# EAGLE schematic H05 (EAGLE 6.6.0)

## Sheet 1 of 4
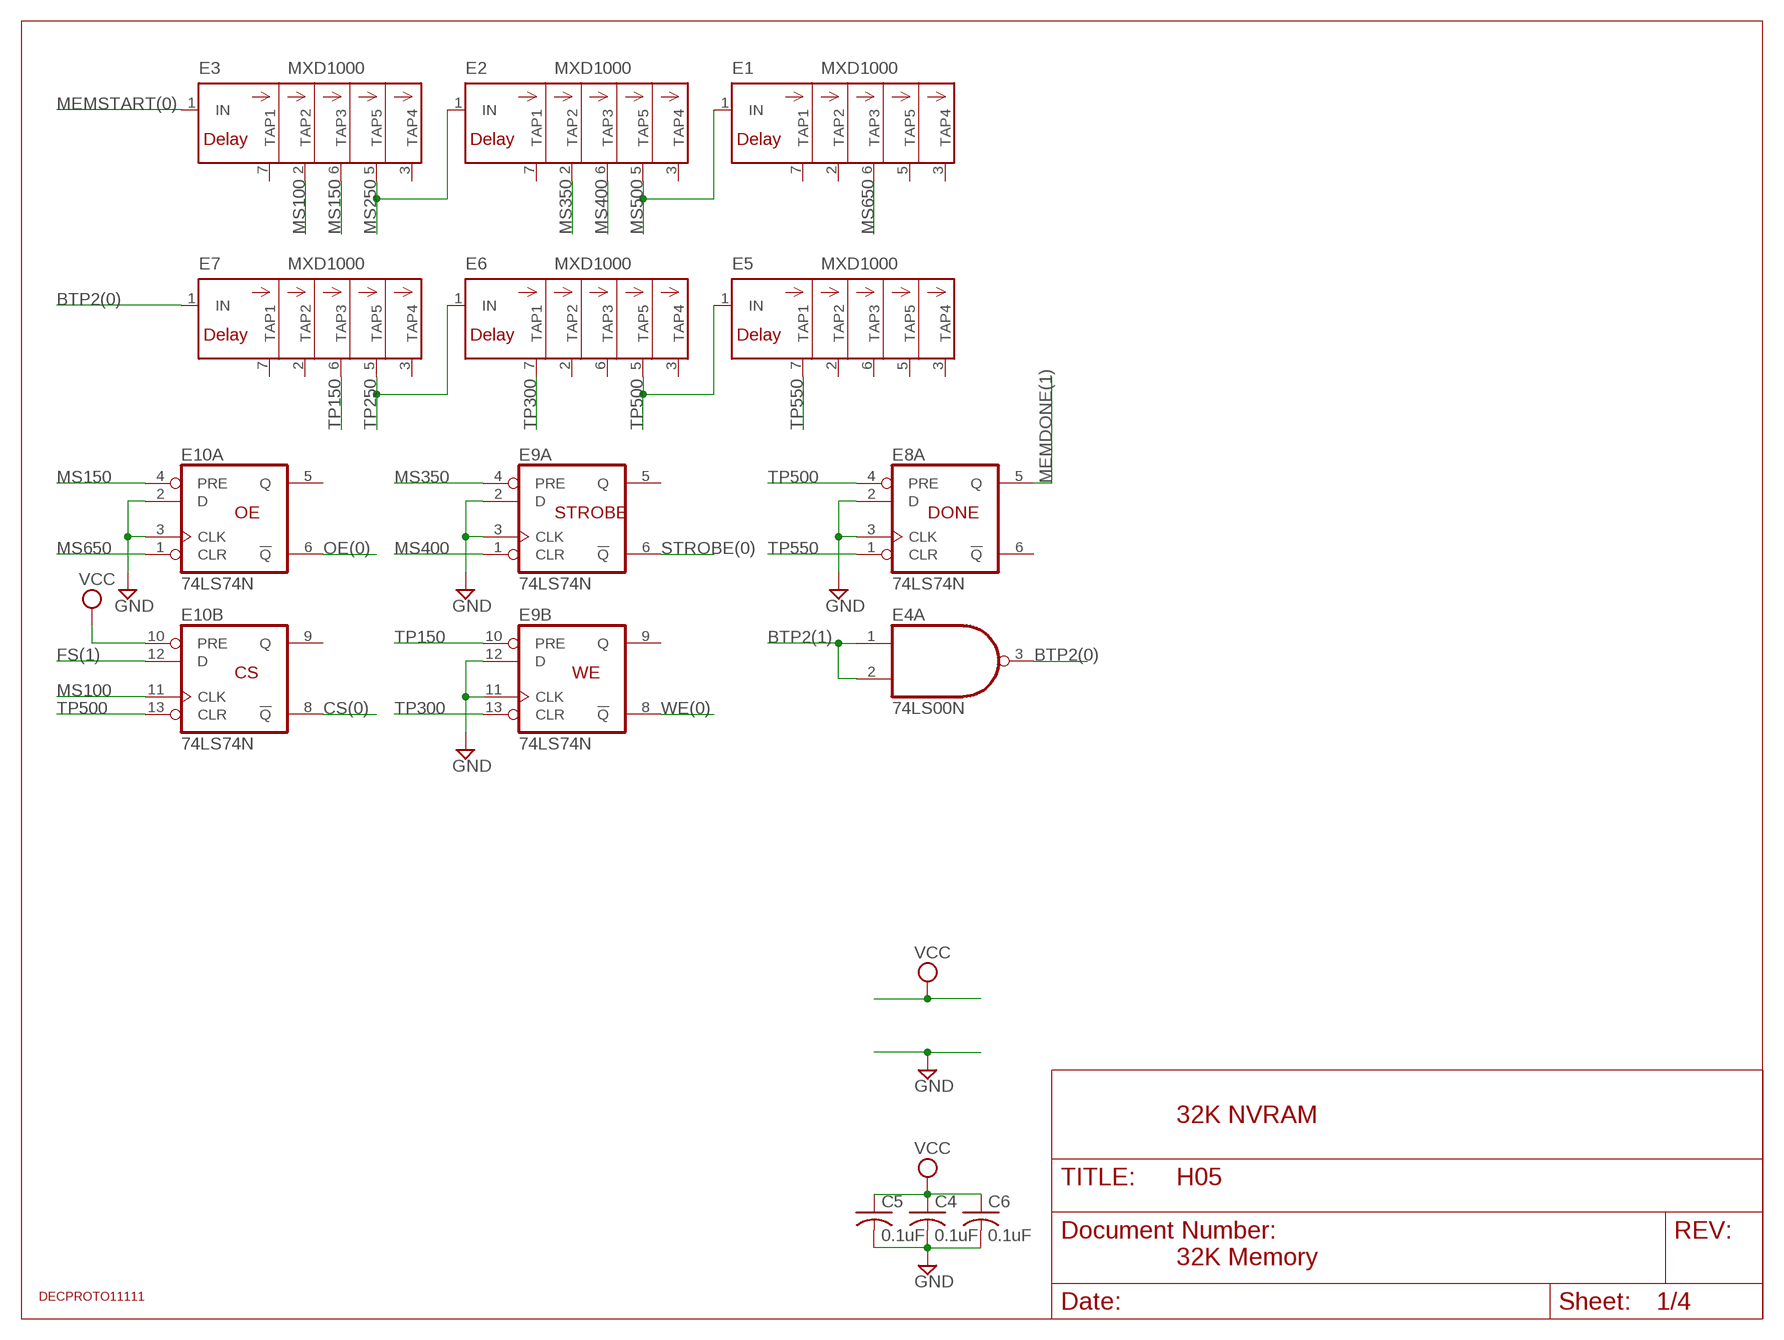
[diagram p0: schematic, sheet 1]

### Parts
C4  0.1uF  C-US050-025X075  [C050-025X075]
C5  0.1uF  C-US050-025X075  [C050-025X075]
C6  0.1uF  C-US050-025X075  [C050-025X075]
E1  MXD1000  [DIL08]
E2  MXD1000  [DIL08]
E3  MXD1000  [DIL08]
E4  74LS00N  [DIL14]
E5  MXD1000  [DIL08]
E6  MXD1000  [DIL08]
E7  MXD1000  [DIL08]
E8  74LS74N  [DIL14]
E9  74LS74N  [DIL14]
E10  74LS74N  [DIL14]
U$6  DECPROTO11111  [DECPROTO11111]

### Nets
BTP2(0): E4.3(A:O) E7.1(IN)
BTP2(1): E4.1(A:I0) E4.2(A:I1) ; also sheet 2
CS(0): E10.8(B:!Q) ; also sheet 3
FS(1): E10.12(B:D) ; also sheet 3
GND [supply]: C4.2 C5.2 C6.2 E8.2(A:D) E8.3(A:CLK) E9.2(A:D) E9.3(A:CLK) E9.11(B:CLK) E9.12(B:D) E10.2(A:D) E10.3(A:CLK) ; also sheet 2,3
MEMDONE(1): E8.5(A:Q) ; also sheet 2
MEMSTART(0): E3.1(IN) ; also sheet 2
MS100: E3.2(TAP2) E10.11(B:CLK)
MS150: E3.6(TAP3) E10.4(A:PRE)
MS250: E2.1(IN) E3.5(TAP5)
MS350: E2.2(TAP2) E9.4(A:PRE)
MS400: E2.6(TAP3) E9.1(A:CLR)
MS500: E1.1(IN) E2.5(TAP5)
MS650: E1.6(TAP3) E10.1(A:CLR)
OE(0): E10.6(A:!Q) ; also sheet 3
STROBE(0): E9.6(A:!Q) ; also sheet 2
TP150: E7.6(TAP3) E9.10(B:PRE)
TP250: E6.1(IN) E7.5(TAP5)
TP300: E6.7(TAP1) E9.13(B:CLR)
TP500: E5.1(IN) E6.5(TAP5) E8.4(A:PRE) E10.13(B:CLR)
TP550: E5.7(TAP1) E8.1(A:CLR)
VCC [supply]: C4.1 C5.1 C6.1 E10.10(B:PRE) ; also sheet 2
WE(0): E9.8(B:!Q) ; also sheet 3
Unconnected: E1.2(TAP2) E1.3(TAP4) E1.5(TAP5) E1.7(TAP1) E2.3(TAP4) E2.7(TAP1) E3.3(TAP4) E3.7(TAP1) E4.4(B:I0) E4.5(B:I1) E4.6(B:O) E4.8(C:O) E4.9(C:I0) E4.10(C:I1) E4.11(D:O) E4.12(D:I0) E4.13(D:I1) E5.2(TAP2) E5.3(TAP4) E5.5(TAP5) E5.6(TAP3) E6.2(TAP2) E6.3(TAP4) E6.6(TAP3) E7.2(TAP2) E7.3(TAP4) E7.7(TAP1) E8.6(A:!Q) E8.8(B:!Q) E8.9(B:Q) E8.10(B:PRE) E8.11(B:CLK) E8.12(B:D) E8.13(B:CLR) E9.5(A:Q) E9.9(B:Q) E10.5(A:Q) E10.9(B:Q)

### Notes on the sheet
- OE | STROBE | DONE
- CS | WE
- 32K NVRAM
- 32K Memory

## Sheet 2 of 4
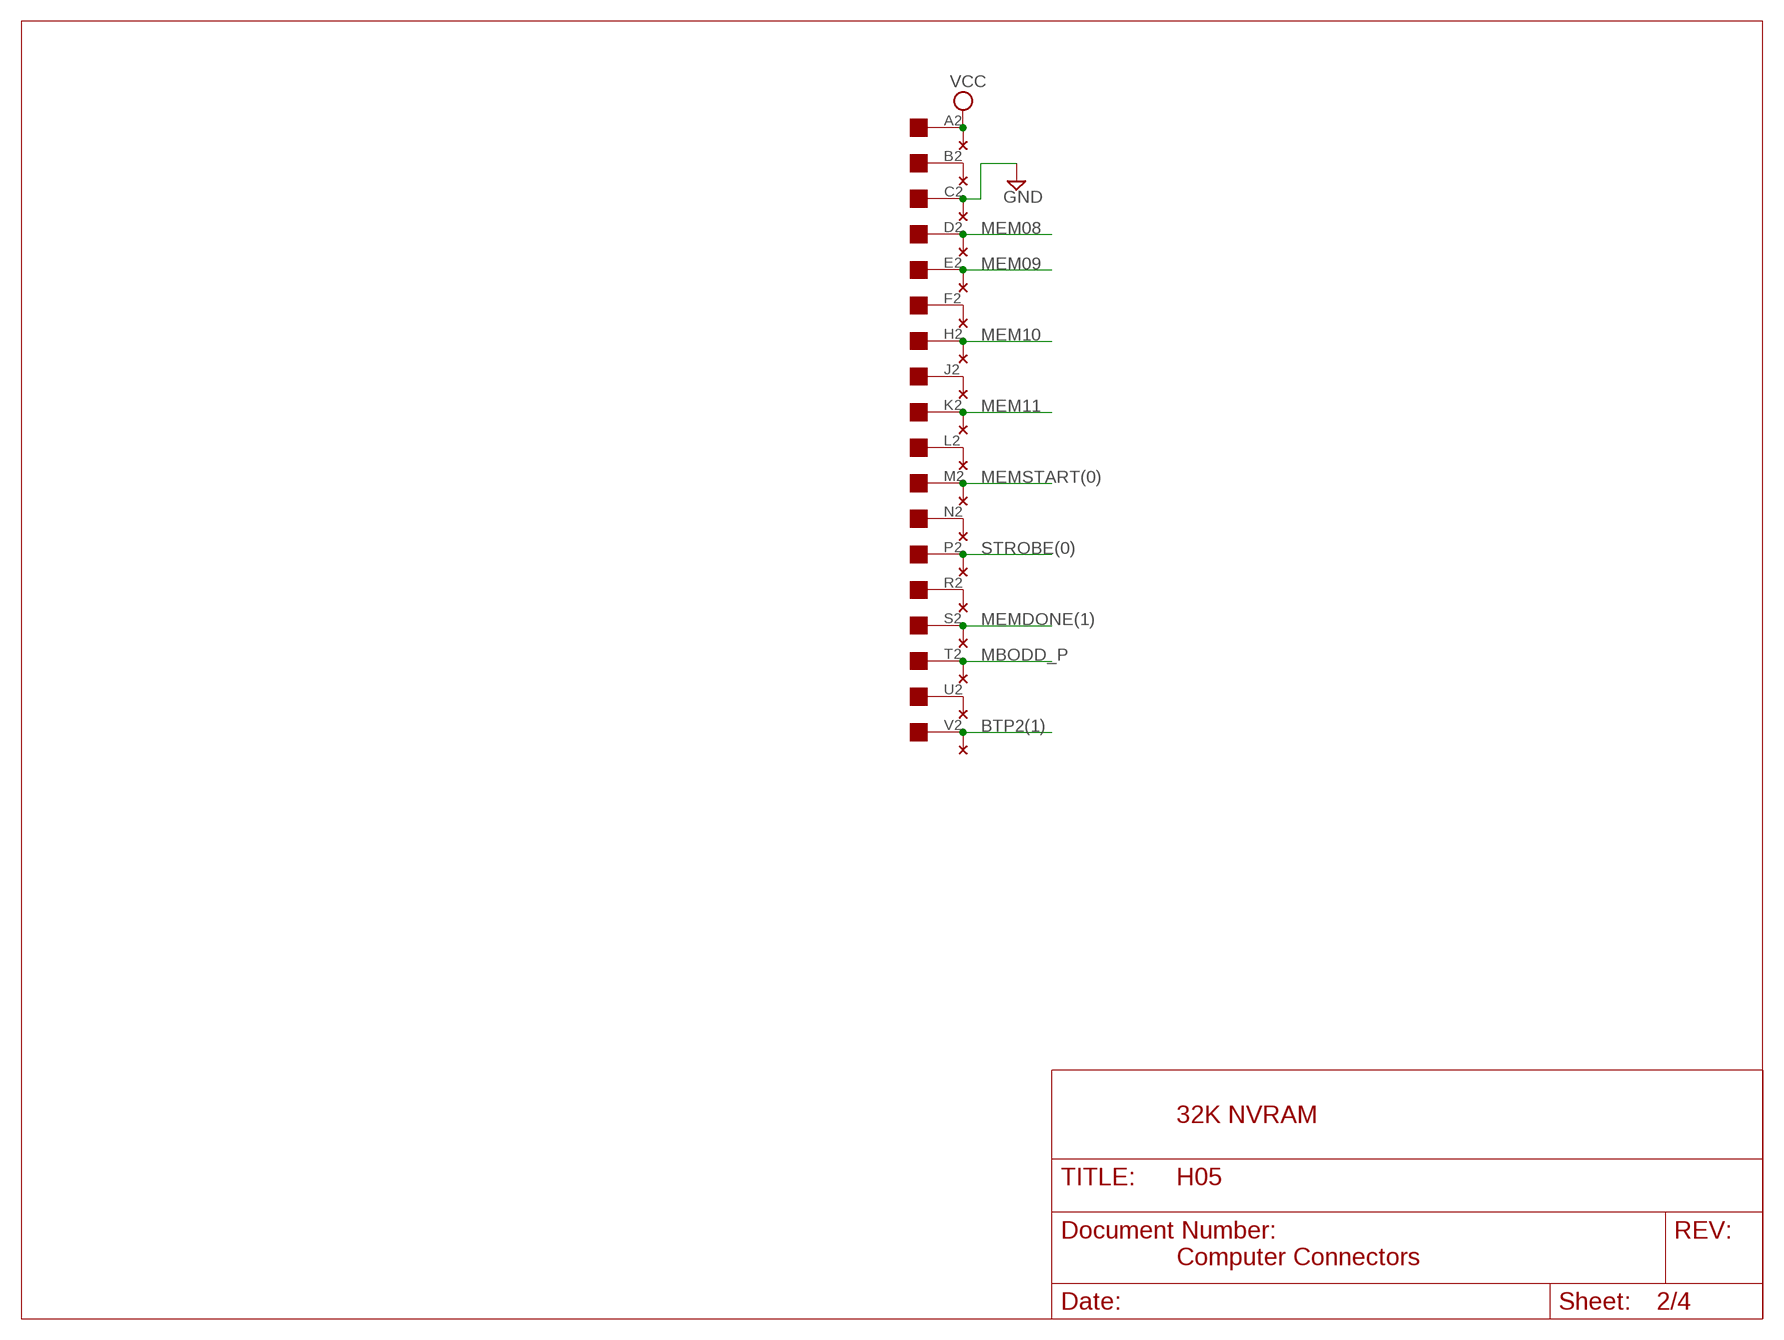
[diagram p1: schematic, sheet 2]

### Parts
H05  EDGE-1  [EDGE-CON1]
U$5  THRU-HOLE2  [THRU-HOLEB]

### Nets
BTP2(1): H05.V2 U$5.V2 ; also sheet 1
GND [supply]: H05.C2 U$5.C2 ; also sheet 1,3
MBODD_P: H05.T2 U$5.T2 ; also sheet 3
MEM08: H05.D2 U$5.D2 ; also sheet 3
MEM09: H05.E2 U$5.E2 ; also sheet 3
MEM10: H05.H2 U$5.H2 ; also sheet 3
MEM11: H05.K2 U$5.K2 ; also sheet 3
MEMDONE(1): H05.S2 U$5.S2 ; also sheet 1
MEMSTART(0): H05.M2 U$5.M2 ; also sheet 1
N$87: H05.J2 U$5.J2
N$88: H05.L2 U$5.L2
N$89: H05.N2 U$5.N2
N$90: H05.F2 U$5.F2
N$91: H05.R2 U$5.R2
N$92: H05.B2 U$5.B2
N$93: H05.U2 U$5.U2
STROBE(0): H05.P2 U$5.P2 ; also sheet 1
VCC [supply]: H05.A2 U$5.A2 ; also sheet 1
Unconnected: U$5.A1 U$5.B1 U$5.C1 U$5.D1 U$5.E1 U$5.F1 U$5.H1 U$5.J1 U$5.K1 U$5.L1 U$5.M1 U$5.N1 U$5.P1 U$5.R1 U$5.S1 U$5.T1 U$5.U1 U$5.V1

### Notes on the sheet
- 32K NVRAM
- Computer Connectors

## Sheet 3 of 4
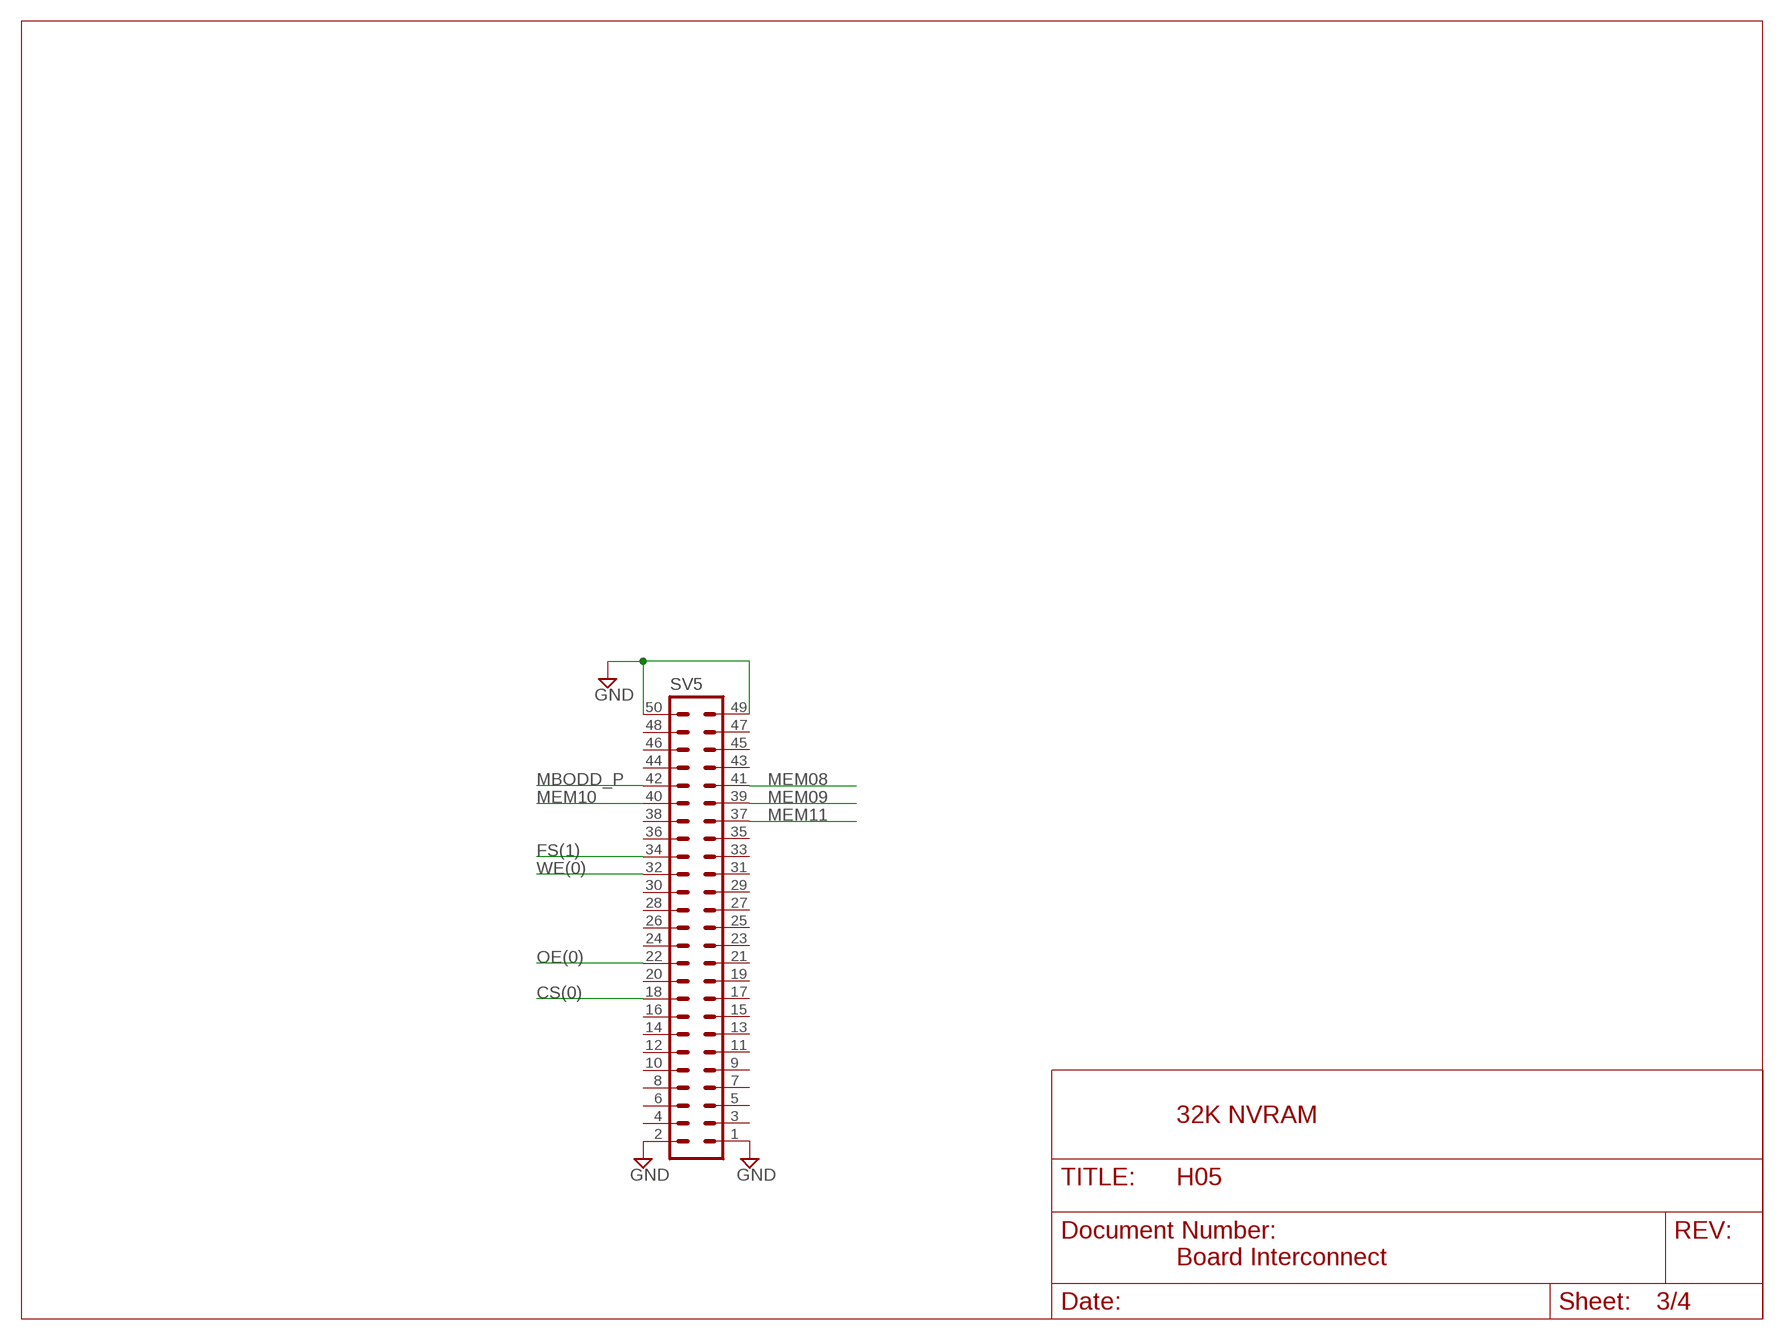
[diagram p2: schematic, sheet 3]

### Parts
SV5  ML50L  [ML50L]

### Nets
CS(0): SV5.18 ; also sheet 1
FS(1): SV5.34 ; also sheet 1
GND [supply]: SV5.1 SV5.2 SV5.49 SV5.50 ; also sheet 1,2
MBODD_P: SV5.42 ; also sheet 2
MEM08: SV5.41 ; also sheet 2
MEM09: SV5.39 ; also sheet 2
MEM10: SV5.40 ; also sheet 2
MEM11: SV5.37 ; also sheet 2
OE(0): SV5.22 ; also sheet 1
WE(0): SV5.32 ; also sheet 1
Unconnected: SV5.3 SV5.4 SV5.5 SV5.6 SV5.7 SV5.8 SV5.9 SV5.10 SV5.11 SV5.12 SV5.13 SV5.14 SV5.15 SV5.16 SV5.17 SV5.19 SV5.20 SV5.21 SV5.23 SV5.24 SV5.25 SV5.26 SV5.27 SV5.28 SV5.29 SV5.30 SV5.31 SV5.33 SV5.35 SV5.36 SV5.38 SV5.43 SV5.44 SV5.45 SV5.46 SV5.47 SV5.48

### Notes on the sheet
- 32K NVRAM
- Board Interconnect

## Sheet 4 of 4
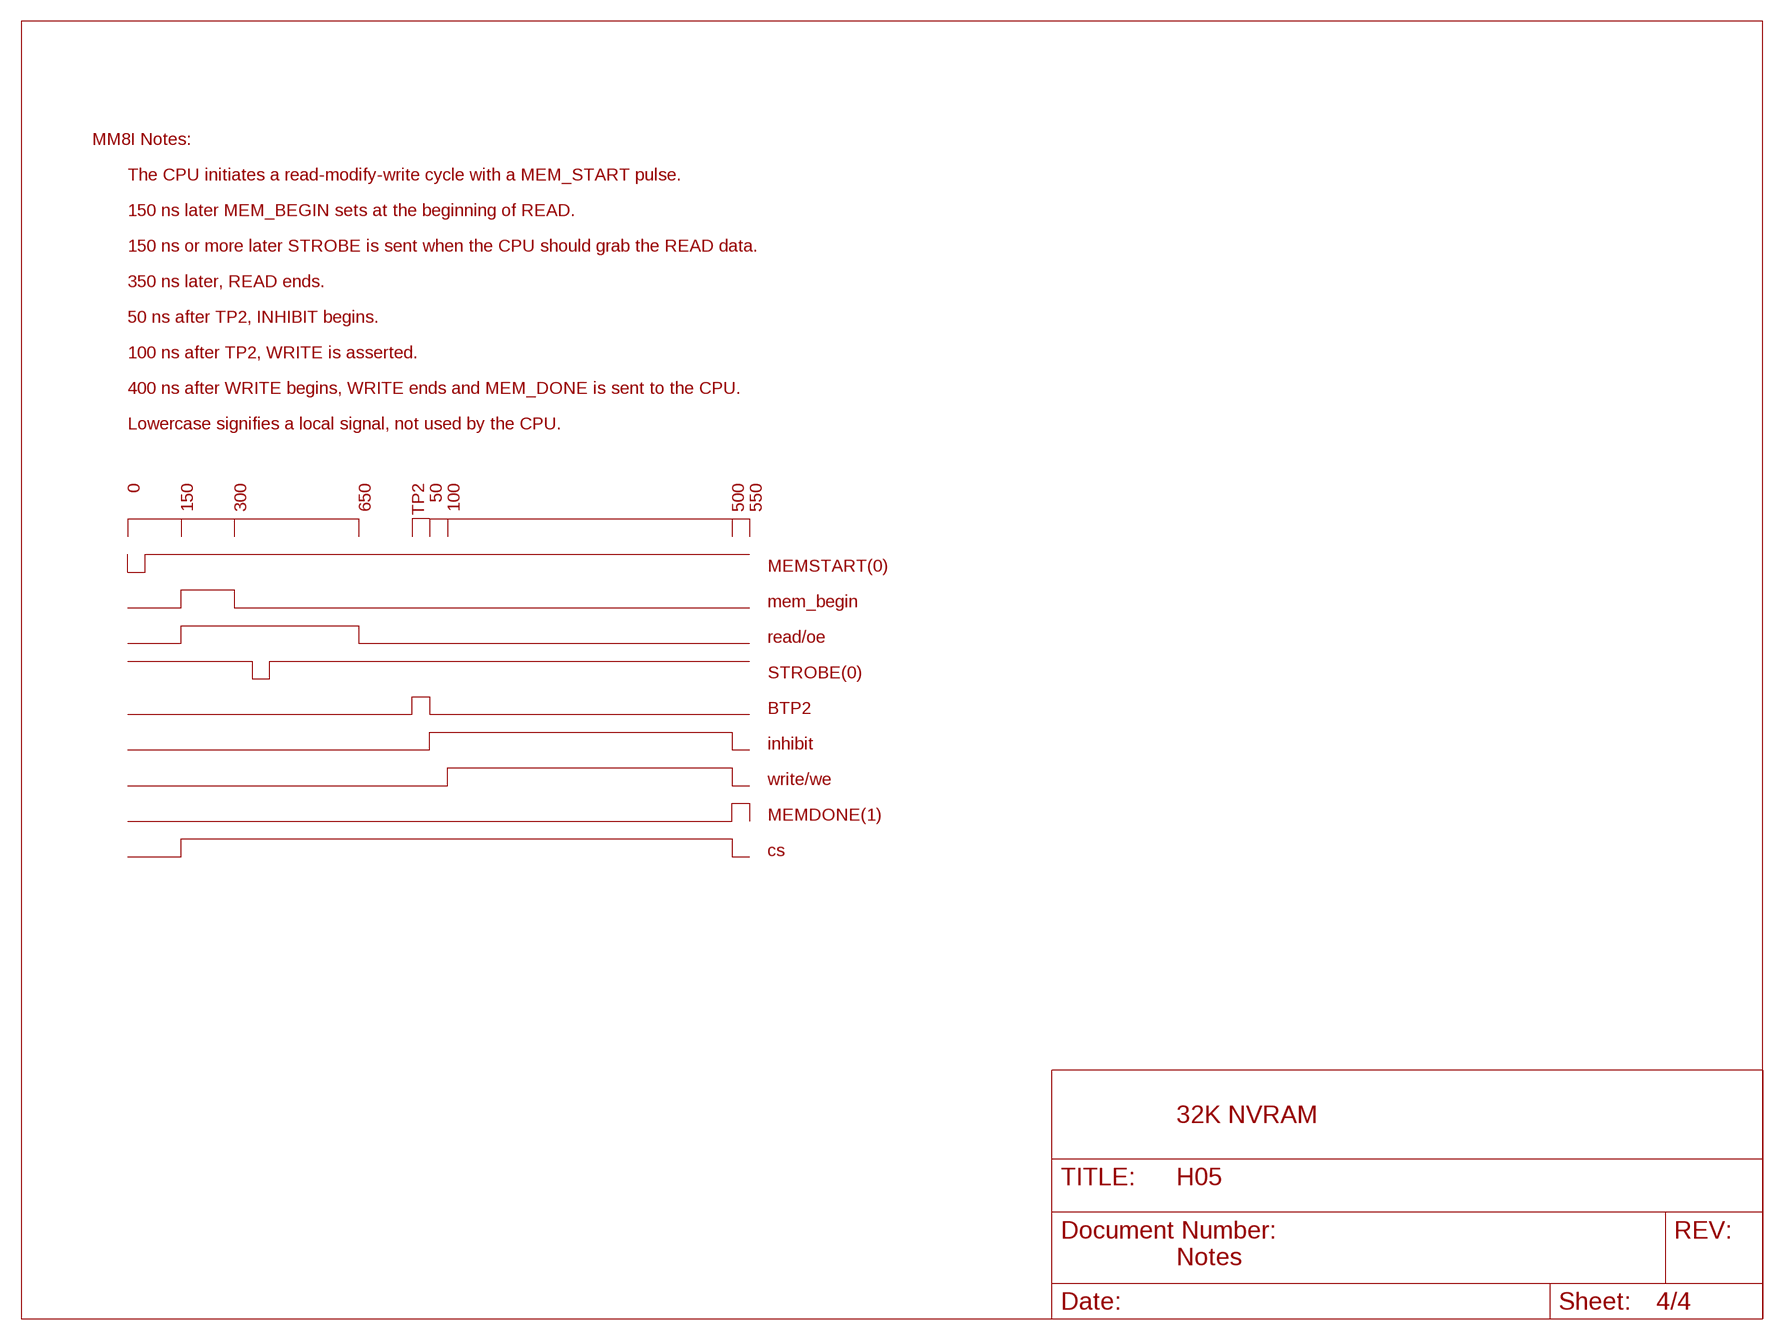
[diagram p3: schematic, sheet 4]

### Notes on the sheet
- MM8I Notes:
- The CPU initiates a read-modify-write cycle with a MEM_START pulse.
- 150 ns later MEM_BEGIN sets at the beginning of READ.
- 150 ns or more later STROBE is sent when the CPU should grab the READ data.
- 350 ns later, READ ends.
- 50 ns after TP2, INHIBIT begins.
- 100 ns after TP2, WRITE is asserted.
- 400 ns after WRITE begins, WRITE ends and MEM_DONE is sent to the CPU.
- Lowercase signifies a local signal, not used by the CPU.
- 0 | 150 | 300 | 650 | TP2 | 50 | 100 | 500 | 550
- MEMSTART(0)
- mem_begin
- read/oe
- STROBE(0)
- BTP2
- inhibit
- write/we
- MEMDONE(1)
- cs
- 32K NVRAM
- Notes

## Power pins joined to a net without a drawn wire
GND: E1.4(GND) E2.4(GND) E3.4(GND) E4.7(P:GND) E5.4(GND) E6.4(GND) E7.4(GND) E8.7(P:GND) E9.7(P:GND) E10.7(P:GND)
VCC: E1.8(VCC) E2.8(VCC) E3.8(VCC) E4.14(P:VCC) E5.8(VCC) E6.8(VCC) E7.8(VCC) E8.14(P:VCC) E9.14(P:VCC) E10.14(P:VCC)

## Library data of the parts
C4-C6 = rcl:C-US: CAPACITOR, American symbol
E1-E3 E5-E7 = maxim:MXD1000: DELAY LINE; OC_FARNELL: unknown; OC_NEWARK: unknown
E4 = 74xx-us:74*00: Quad 2-input NAND gate
E8-E10 = 74xx-us:74*74: Dual D type positive edge triggered FLIP FLOP, preset and clear
H05 = dec-con:EDGE-1: Single-Sided DEC Edge Connector -- (side 2)
SV5 = con-ml:ML50L: HARTING; OC_FARNELL: unknown; OC_NEWARK: unknown
U$5 = dec-con:THRU-HOLE2: Thru-Hole addition to double-sided edge connector.
U$6 = dec-con:DECPROTO: Various small DEC boards stuck together with break-away tab routing.

## Net classes
1 supply: width 0.711 mm